# EAGLE design Rele_WIFI_6_Board (EAGLE 9.6.2)
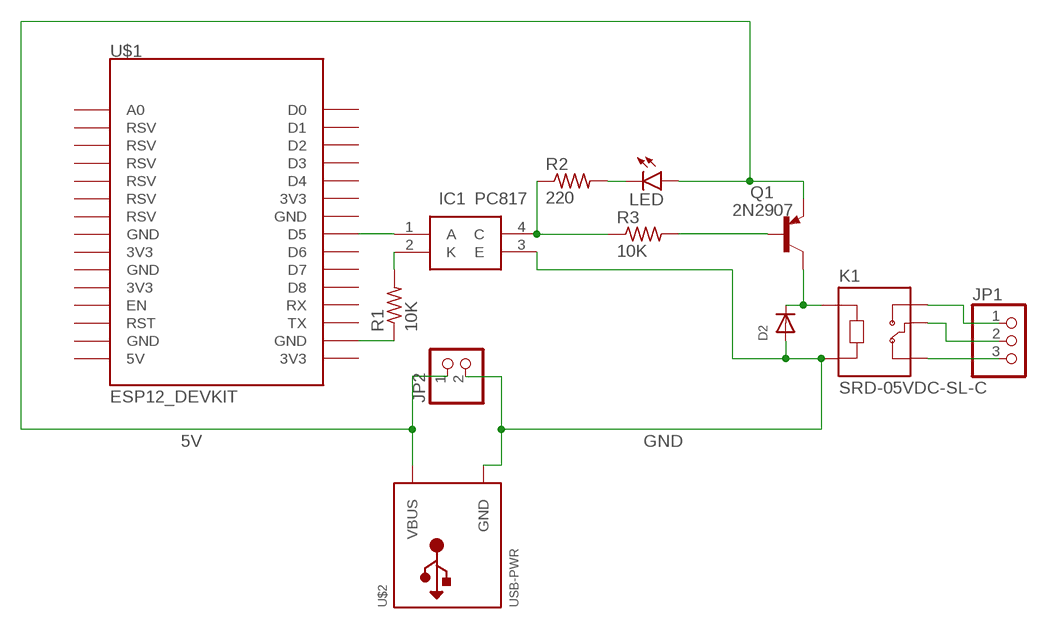
[diagram p0: schematic, sheet 1]

## Parts
D2  DIODEDO-1N4148  [DO-1N4148]
IC1  PC817  [DIP810W60P254L460H500Q4N]
JP1  PINHD-1X3  [1X03]
JP2  PINHD-1X2  [1X02]
K1  SRD-05VDC-SL-C  [RELAY_SRD-05VDC-SL-C]
LED  LED5MM  [LED5MM]
Q1  2N2907  [TO92-EBC-OVAL]
R1  10K  R-US_0309/12  [0309/12]
R2  220  R-US_0309/12  [0309/12]
R3  10K  R-US_0309/12  [0309/12]
U$1  ESP12_DEVKIT  [ESP12_DEVKIT]
U$2  USB-PWR  [USB-MINIB-THM-MOLEX-PWRONLY]

## Nets
5V: JP2.1 LED.A Q1.E U$2.VBUS
GND: D2.A IC1.3(E) JP2.2 K1.A2 U$2.GND
N$1: IC1.1(A) U$1.D5
N$2: IC1.4(C) R2.1 R3.1
N$3: Q1.B R3.2
N$5: IC1.2(K) R1.2
N$6: R1.1 U$1.GND@3(GND)
N$7: LED.K(C) R2.2
N$8: D2.C K1.A1 Q1.C
N$10: JP1.1 K1.NO
N$11: JP1.2 K1.COM
N$12: JP1.3 K1.NC
Unconnected: U$1.3V3@0(3V3) U$1.3V3@1(3V3) U$1.3V3@2(3V3) U$1.3V3@3(3V3) U$1.5V U$1.A0 U$1.D0 U$1.D1 U$1.D2 U$1.D3 U$1.D4 U$1.D6 U$1.D7 U$1.D8 U$1.EN U$1.GND@0(GND) U$1.GND@1(GND) U$1.GND@2(GND) U$1.GND@4(GND) U$1.RST U$1.RSV@0(RSV) U$1.RSV@1(RSV) U$1.RSV@2(RSV) U$1.RSV@3(RSV) U$1.RSV@4(RSV) U$1.RSV@5(RSV) U$1.RX U$1.TX

## Library data of the parts
D2 = adafruit:DIODE: Diode SMADIODE - SMA Surface Mount Package 20V 1A Schottky Diode Digikey: 641-1014-6-ND DO-1N4148 - Through Hole Small Current Diode SOD-123 20V 1 A (.5mV Vf) Schottky Diode - Digikey: MBRX120TPMSCT-ND SOD-323 10V 570mA (.38mV Vf, 3ns) Schottky Diode - Digikey: ZLLS410CT-ND SOD-523 30V 30mA Schottky Diode (RB751S-40TE61) - Digikey: RB751S-40TE61CT-ND SOT23-R/W - SOT23 Package (R = Solder Paste/Reflow Ovens, W = Hand-Soldering) BAT54Film 40V 300mA - Digikey: 497-7162-1-ND
IC1 = PC817:PC817: 4 PIN DIP PHOTOTRANSISTOR PHOTOCOUPLER Source: Datasheet; DESCRIPTION: 4 PIN DIP PHOTOTRANSISTOR PHOTOCOUPLER; HEIGHT: 5mm; MANUFACTURER_NAME: Galaxy; MANUFACTURER_PART_NUMBER: PC817
JP1 = pinhead:PINHD-1X3: PIN HEADER
JP2 = pinhead:PINHD-1X2: PIN HEADER
K1 = SRD-05VDC-SL-C:SRD-05VDC-SL-C: 5V Trigger Relay Module For Arduino And Raspberry Pi 5V Trigger Relay Module For Arduino And Raspberry Pi Check prices <https://pricing.snapeda.com/parts/SRD-05VDC-SL-C/Songle%20Relay/view-part?ref=eda>; AVAILABILITY: Not in stock; DESCRIPTION: 5V Trigger Relay Module For Arduino And Raspberry Pi 5V Trigger Relay Module For Arduino And Raspberry Pi; MF: Songle Relay; MP: SRD-05VDC-SL-C; PACKAGE: None; PRICE: None
LED = led:LED: LED OSRAM: - CHIPLED LG R971, LG N971, LY N971, LG Q971, LY Q971, LO R971, LY R971 LH N974, LH R974 LS Q976, LO Q976, LY Q976 LO Q996 - Hyper CHIPLED LW Q18S LB Q993, LB Q99A, LB R99A - SideLED LS A670, LO A670, LY A670, LG A670, LP A670 LB A673, LV A673, LT A673, LW A673 LH A674 LY A675 LS A676, LA A676, LO A676, LY A676, LW A676 LS A679, LY A679, LG A679 - Hyper Micro SIDELED® LS Y876, LA Y876, LO Y876, LY Y876 LT Y87S - SmartLED LW L88C, LW L88S LB L89C, LB L89S, LG L890 LS L89K, LO L89K, LY L89K LS L896, LA L896, LO L896, LY L896 - TOPLED LS T670, LO T670, LY T670, LG T670, LP T670 LSG T670, LSP T670, LSY T670, LOP T670, LYG T670 LG T671, LOG T671, LSG T671 LB T673, LV T673, LT T673, LW T673 LH T674 LS T676, LA T676, LO T676, LY T676, LB T676, LH T676, LSB T676, LW T676 LB T67C, LV T67C, LT T67C, LS T67K, LO T67K, LY T67K, LW E67C LS E67B, LA E67B, LO E67B, LY E67B, LB E67C, LV E67C, LT E67C LW T67C LS T679, LY T679, LG T679 LS T770, LO T770, LY T770, LG T770, LP T770 LB T773, LV T773, LT T773, LW T773 LH T774 LS E675, LA E675, LY E675, LS T675 LS T776, LA T776, LO T776, LY T776, LB T776 LHGB T686 LT T68C, LB T68C - Hyper Mini TOPLED® LB M676 - Mini TOPLED Santana® LG M470 LS M47K, LO M47K, LY M47K Source: http://www.osram.convergy.de LUXEON: - LUMILED® LXK2-PW12-R00, LXK2-PW12-S00, LXK2-PW14-U00, LXK2-PW14-V00 LXK2-PM12-R00, LXK2-PM12-S00, LXK2-PM14-U00 LXK2-PE12-Q00, LXK2-PE12-R00, LXK2-PE12-S00, LXK2-PE14-T00, LXK2-PE14-U00 LXK2-PB12-K00, LXK2-PB12-L00, LXK2-PB12-M00, LXK2-PB14-N00, LXK2-PB14-P00, LXK2-PB14-Q00 LXK2-PR12-L00, LXK2-PR12-M00, LXK2-PR14-Q00, LXK2-PR14-R00 LXK2-PD12-Q00, LXK2-PD12-R00, LXK2-PD12-S00 LXK2-PH12-R00, LXK2-PH12-S00 LXK2-PL12-P00, LXK2-PL12-Q00, LXK2-PL12-R00 Source: www.luxeon.com KINGBRIGHT: KA-3528ASYC Source: www.kingbright.com
Q1 = adafruit:2N2907*: PNP Transistor Big Oval pads
R1-R3 = rcl:R-US_: RESISTOR, American symbol; SPICEPREFIX: R
U$1 = ESP12_DEVKIT:ESP12_DEVKIT: ESP12 DEVKIT BOARD
U$2 = adafruit:USB-PWR

## Board
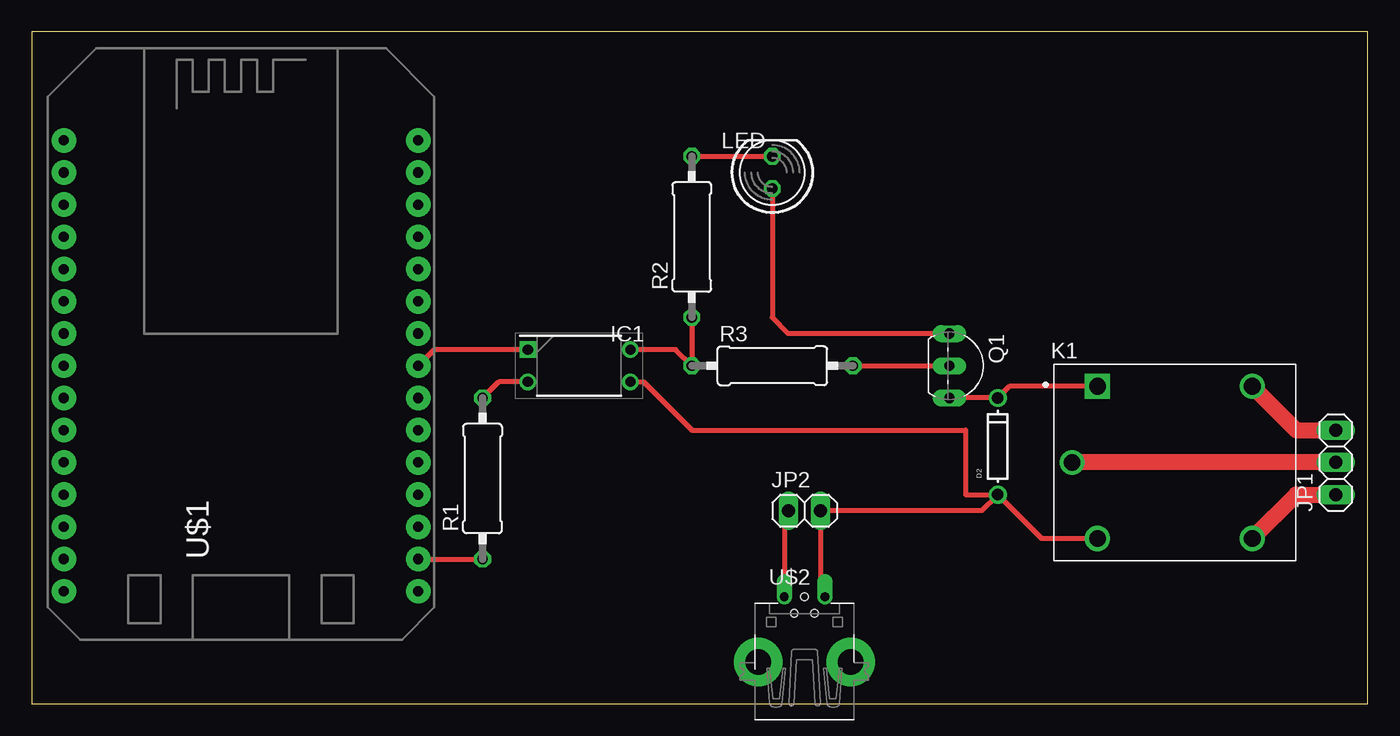
[diagram p1: board, top side]
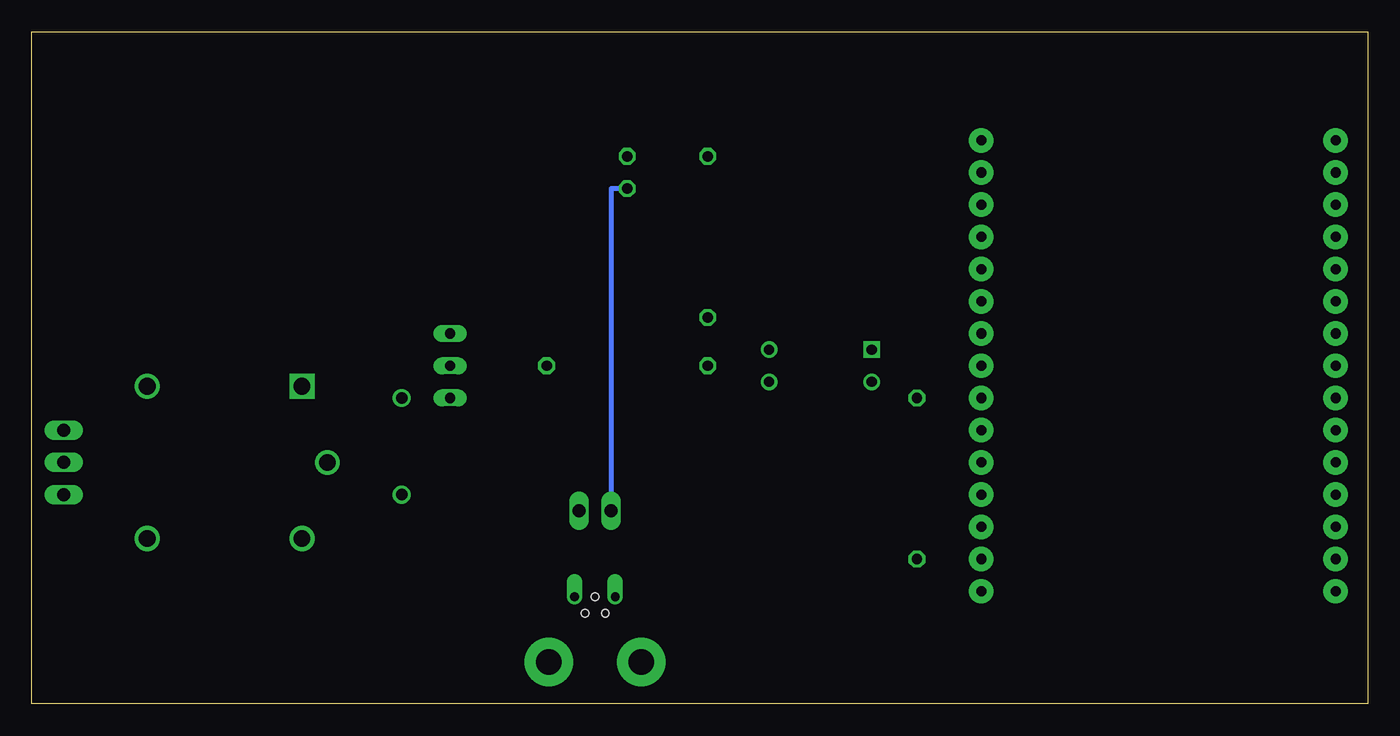
[diagram p2: board, bottom side, seen from below]

Size 105.39 x 53.01 mm. Coordinates in mm from the lower left corner, seen from the top.
Outline: 0,0 105.39,0 105.39,53.01 0,53.01 0,0
Copper layers (1*16): Top 0.035mm / dielectric 1.5mm / Bottom 0.035mm
Design rules "default": minimum track width 6mil, minimum drill 0.35mm, track to track 6mil, track to pad 6mil, pad to pad 6mil, via to via 6mil, smd to smd 6mil, copper to edge 40mil, drill to drill 6mil, minimum pad ring 10mil, minimum via ring 8mil, stop-mask expansion 4mil, vias tented up to drill 0mil, thermal gap 10mil

### Footprints (pad centres in the part's own frame; a part is rotated, then mirrored left to right if it is on the bottom)
DO-1N4148 = drill 0.9: A -3.81,0; C 3.81,0
DIP810W60P254L460H500Q4N = drill 0.8 pad 1.2 square: 1 -4.05,1.27 | drill 0.8 pad 1.2: 2 -4.05,-1.27; 3 4.05,-1.27; 4 4.05,1.27
1X03 = drill 1.016 long: 1 -2.54,0; 2 0,0; 3 2.54,0
1X02 = drill 1.016 long: 1 -1.27,0; 2 1.27,0
RELAY_SRD-05VDC-SL-C = drill 1.32 square: A1 -6.1,6 | drill 1.32: A2 -6.1,-6; NC 6.1,6; NO 6.1,-6 | drill 1.29: COM -8.1,0
LED5MM = drill 0.813 octagon: A -1.27,0; K 1.27,0
TO92-EBC-OVAL = drill 0.813 long: B 0,-1.27; C 2.54,-1.27; E -2.54,-1.27
0309/12 = drill 0.813 octagon: 1 -6.35,0; 2 6.35,0
ESP12_DEVKIT = drill 0.8 pad 1.93: 3V3@0 -13.97,-7.62; 3V3@1 13.97,5.08; 3V3@2 13.97,-17.78; 3V3@3 -13.97,-2.54; 5V -13.97,-17.78; A0 -13.97,17.78; D0 13.97,17.78; D1 13.97,15.24; D2 13.97,12.7; D3 13.97,10.16; D4 13.97,7.62; D5 13.97,0; D6 13.97,-2.54; D7 13.97,-5.08; D8 13.97,-7.62; EN -13.97,-10.16; GND@0 -13.97,-5.08; GND@1 -13.97,-15.24; GND@2 13.97,2.54; GND@3 13.97,-15.24; GND@4 -13.97,0; RST -13.97,-12.7; RSV@0 -13.97,15.24; RSV@1 -13.97,12.7; RSV@2 -13.97,10.16; RSV@3 -13.97,7.62; RSV@4 -13.97,5.08; RSV@5 -13.97,2.54; RX 13.97,-10.16; TX 13.97,-12.7
USB-MINIB-THM-MOLEX-PWRONLY = drill 0.7 offset: GND 1.6,4.64; VBUS -1.6,4.64 | drill 2 pad 3.81: GND1 -3.65,-0.51; GND4 3.65,-0.51 | hole 0.6: 0,4.648; 0.787,3.353; -0.813,3.353

### Placement (x,y rotation side)
D2  76.2,20.32 90 top
IC1  43.18,26.67 0 top
JP1  102.87,19.05 90 top
JP2  60.96,15.24 0 top
K1  90.17,19.05 0 top
LED  58.42,41.91 90 top
Q1  73.66,26.67 270 top
R1  35.56,17.78 90 top
R2  52.07,36.83 90 top
R3  58.42,26.67 0 top
U$1  16.51,26.67 0 top
U$2  60.96,3.81 0 top

### Tracks (layer width: path | path; a pad name or v marks a point on that pad's centre or on a via)
5V
  Top 0.4: Q1.E 59.69,29.21 58.42,30.48 LED.A | JP2.1 59.36,14.91 U$2.VBUS
  Bottom 0.4: LED.A 59.69,40.64 JP2.1
GND
  Top 0.4: U$2.GND 62.23,8.78 JP2.2 74.93,15.24 D2.A | IC1.3 48.26,25.4 52.07,21.59 73.66,21.59 73.66,16.51 D2.A | D2.A 79.66,13.05 K1.A2
N$1
  Top 0.4: IC1.1 31.75,27.94 U$1.D5
N$2
  Top 0.4: IC1.4 50.8,27.94 R3.1 R2.1
N$3
  Top 0.4: R3.2 Q1.B
N$5
  Top 0.4: IC1.2 36.83,25.4 R1.2
N$6
  Top 0.4: U$1.GND@3 R1.1
N$7
  Top 0.4: R2.2 LED.K
N$8
  Top 0.4: Q1.C D2.C 77.12,25.05 K1.A1
N$10
  Top 1.27: K1.NO 99.73,16.51 JP1.1
N$11
  Top 1.27: JP1.2 K1.COM
N$12
  Top 1.27: K1.NC 99.73,21.59 JP1.3